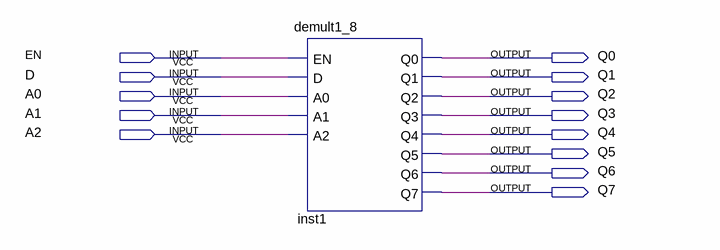
[diagram p0: schematic sheet]
// Quartus schematic Lab3_1.bdf as structural Verilog: 1 symbols, 13 pins
module Lab3_1 (
  input  EN,
  input  D,
  input  A0,
  input  A1,
  input  A2,
  output Q0,
  output Q1,
  output Q2,
  output Q3,
  output Q4,
  output Q5,
  output Q6,
  output Q7
);

  demult1_8 inst1 (
    .EN(EN), .D(D), .A0(A0), .A1(A1), .A2(A2), .Q0(Q0), .Q1(Q1), .Q2(Q2), .Q3(Q3), .Q4(Q4), .Q5(Q5), .Q6(Q6),
    .Q7(Q7));
endmodule
